# Altium schematic sheet Power&typec.SchDoc
size A3; Organization: Altium Limited; Address1: L3, 12a Rodborough Rd; Address2: Frenchs Forest; Address3: NSW; Address4: Australia 2086
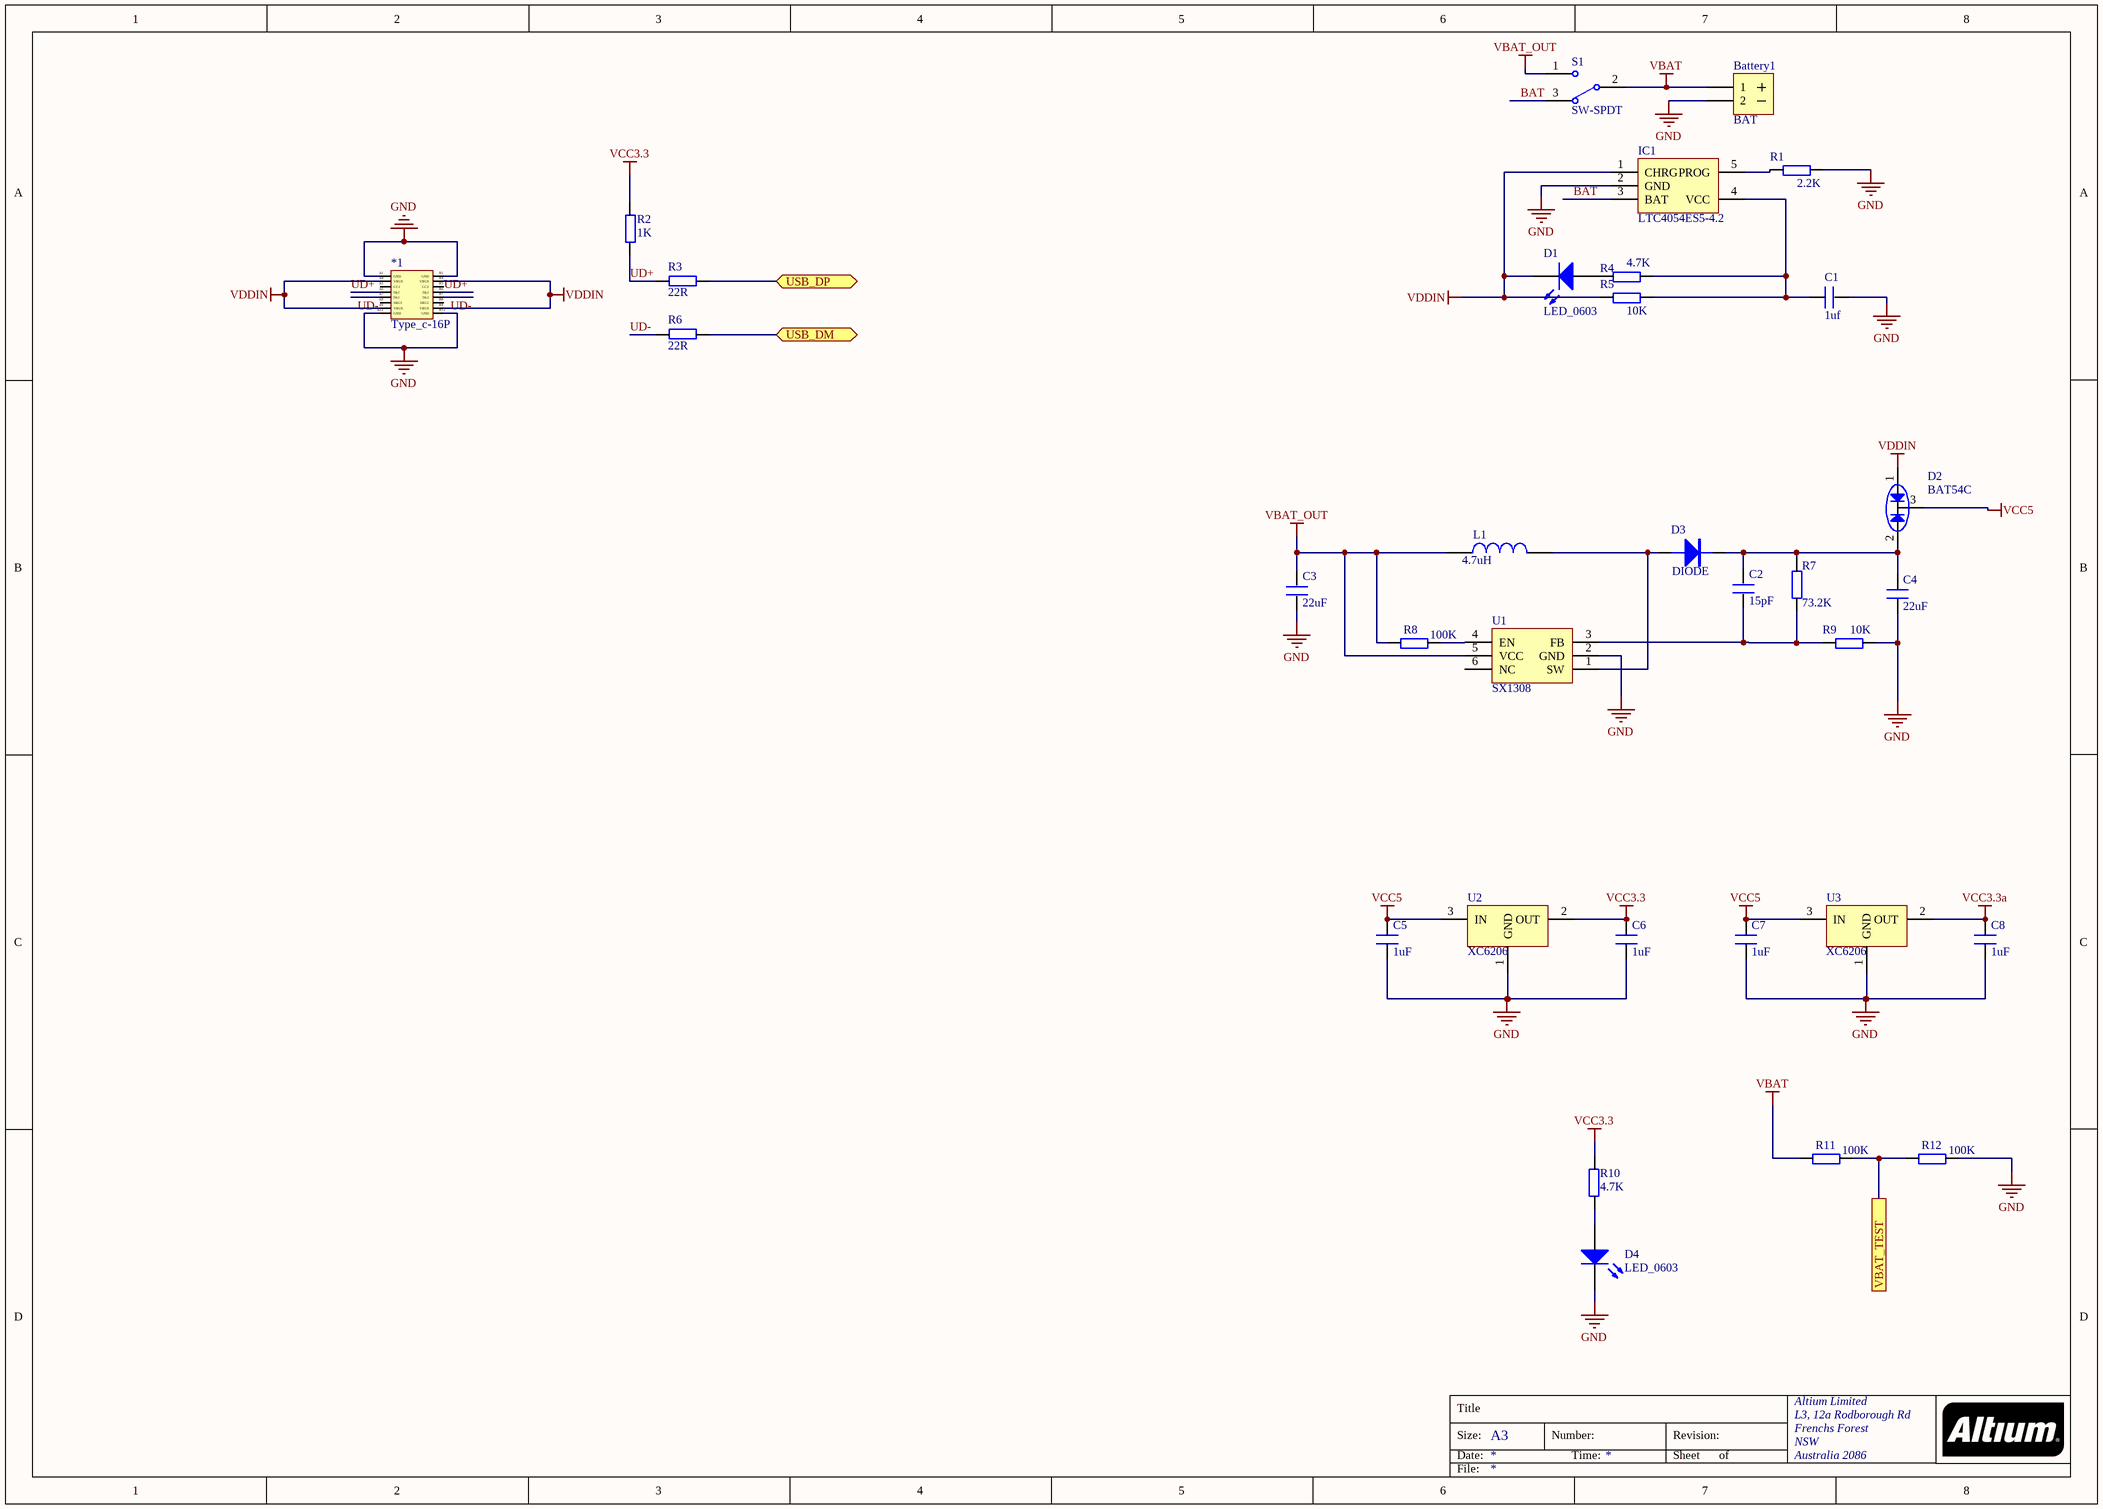
[diagram p0: Power&typec.SchDoc]

## Parts
*1  Type_c-16P  [TYPE-C-16P]
Battery1  BAT  [BAT]
C1  1uf  [0603P]
C2  15pF  [0603P]
C3  22uF  [0603P]
C4  22uF  [0603P]
C5  1uF  [0603P]
C6  1uF  [0603P]
C7  1uF  [0603P]
C8  1uF  [0603P]
D1  LED_0603  [LED-0603]
D2  BAT54C  [SOT23-3M]
D3  DIODE  [SMA/DO-214AC]
D4  LED_0603  [LED-0603]
IC1  LTC4054ES5-4.2  [SOT23-5M]
L1  INDUCTOR  [AL0204]  (value not drawn)
R1  2.2K  [0603P]
R2  1K  [0603P]
R3  22R  [0603P]
R4  4.7K  [0603P]
R5  10K  [0603P]
R6  22R  [0603P]
R7  73.2K  [0603P]
R8  100K  [0603P]
R9  10K  [0603P]
R10  4.7K  [0603P]
R11  100K  [0603P]
R12  100K  [0603P]
S1  SW-SPDT  [SWITCH_PWR]
U1  SX1308  [SOT23-6]
U2  XC6206  [SOT23-3M]
U3  XC6206  [SOT23-3M]

## Ports
USB_DM, USB_DP, VBAT_TEST

## Nets
GND: *1.A1(GND) *1.A12(GND) *1.B1(GND) *1.B12(GND) Battery1.2 C1.2 C3.2 C4.2 C5.2 C6.2 C7.2 C8.2 D4.2 IC1.2(GND) R1.2 R9.2 R12.2 U1.2(GND) U2.1(GND) U3.1(GND)
VBAT: Battery1.1 R11.1 S1.2
VBAT_OUT: C3.1 L1.1 R8.1 S1.1 U1.5(VCC)
VCC3.3: C6.1 R2.2 R10.1 U2.2(OUT)
VCC3.3a: C8.1 U3.2(OUT)
VCC5: C5.1 C7.1 D2.3 U2.3(IN) U3.3(IN)
VDDIN: *1.A4(VBUS) *1.A9(VBUS) *1.B4(VBUS) *1.B9(VBUS) D1.2 D2.1 IC1.1(CHRG) R5.1
BAT: IC1.3(BAT) S1.3
UD+: *1.A6(Dp1) *1.B6(Dp2) R2.1 R3.2
UD-: *1.A7(Dn1) *1.B7(Dn2) R6.2
USB_DM: R6.1 ; port USB_DM
USB_DP: R3.1 ; port USB_DP
VBAT_TEST: R11.2 R12.1 ; port VBAT_TEST
NetC1_1: C1.1 IC1.4(VCC) R4.2 R5.2
NetC2_1: C2.1 C4.1 D2.2 D3.K R7.2
NetC2_2: C2.2 R7.1 R9.1 U1.3(FB)
NetD1_1: D1.1 R4.1
NetD3_A: D3.A L1.2 U1.1(SW)
NetD4_1: D4.1 R10.2
NetIC1_5: IC1.5(PROG) R1.1
NetR8_2: R8.2 U1.4(EN)

Not connected (* = marked no-connect by the designer): *1 A5(CC1) A8(SBU1) B5(CC2) B8(SBU2); U1 6(NC)

## Notes on the sheet
- Title
- Size:
- Date:
- A3
- Number:
- Time:
- Revision:
- Sheet
- of
- File:
- (in symbol INDUCTOR) 4.7uH

## Library data of the parts
Battery1 = BAT: Header, 2-Pin; Publisher: mazhongwei; Published: 8-August-2017; PackageReference: HDR1X2
C1-C8 = C
D1 D4 = LED 0603: 发光二极管; Published: 8-Jun-2000; LatestRevisionDate: 08-Jul-2005; LatestRevisionNote: Mech Layer 1 removed.; PackageReference: LED-0; Publisher: Altium Limited; PackageDescription: LED; 2 Leads
D2 = BAT54C: 表贴肖特基二极管; BOM名称: 肖特基二极管; 版权归属: 源创客; 属性: 30V/0.2A; 学习资源: www.ooocke.com
D3 = DIODE: 普通二极管
IC1 = LTC4054: 锂电池充电芯片; 版权归属: 源创客; BOM名称: 锂电池充电芯片; 学习资源: www.ooocke.com
R1-R12 = R
S1 = SW-SPDT: SPDT Subminiature Toggle Switch, Right Angle Mounting, Vertical Actuation; Published: 10-August-2017; PackageReference: SWITCH_PWR; Publisher: mazhongwei
U1 = SX1308: 可调升压芯片
U2 U3 = XC6206: PackageReference: SOT23-3; Published: 12-August-2017; Publisher: mazhongwei